# EasyEDA schematic main board_schematic.json
TITLE: Sheet_1; REV: 1.0; Date: 2021-07-18; Sheet: 1/1; Drawn By: Gustavo Moraes; Company: Your Company
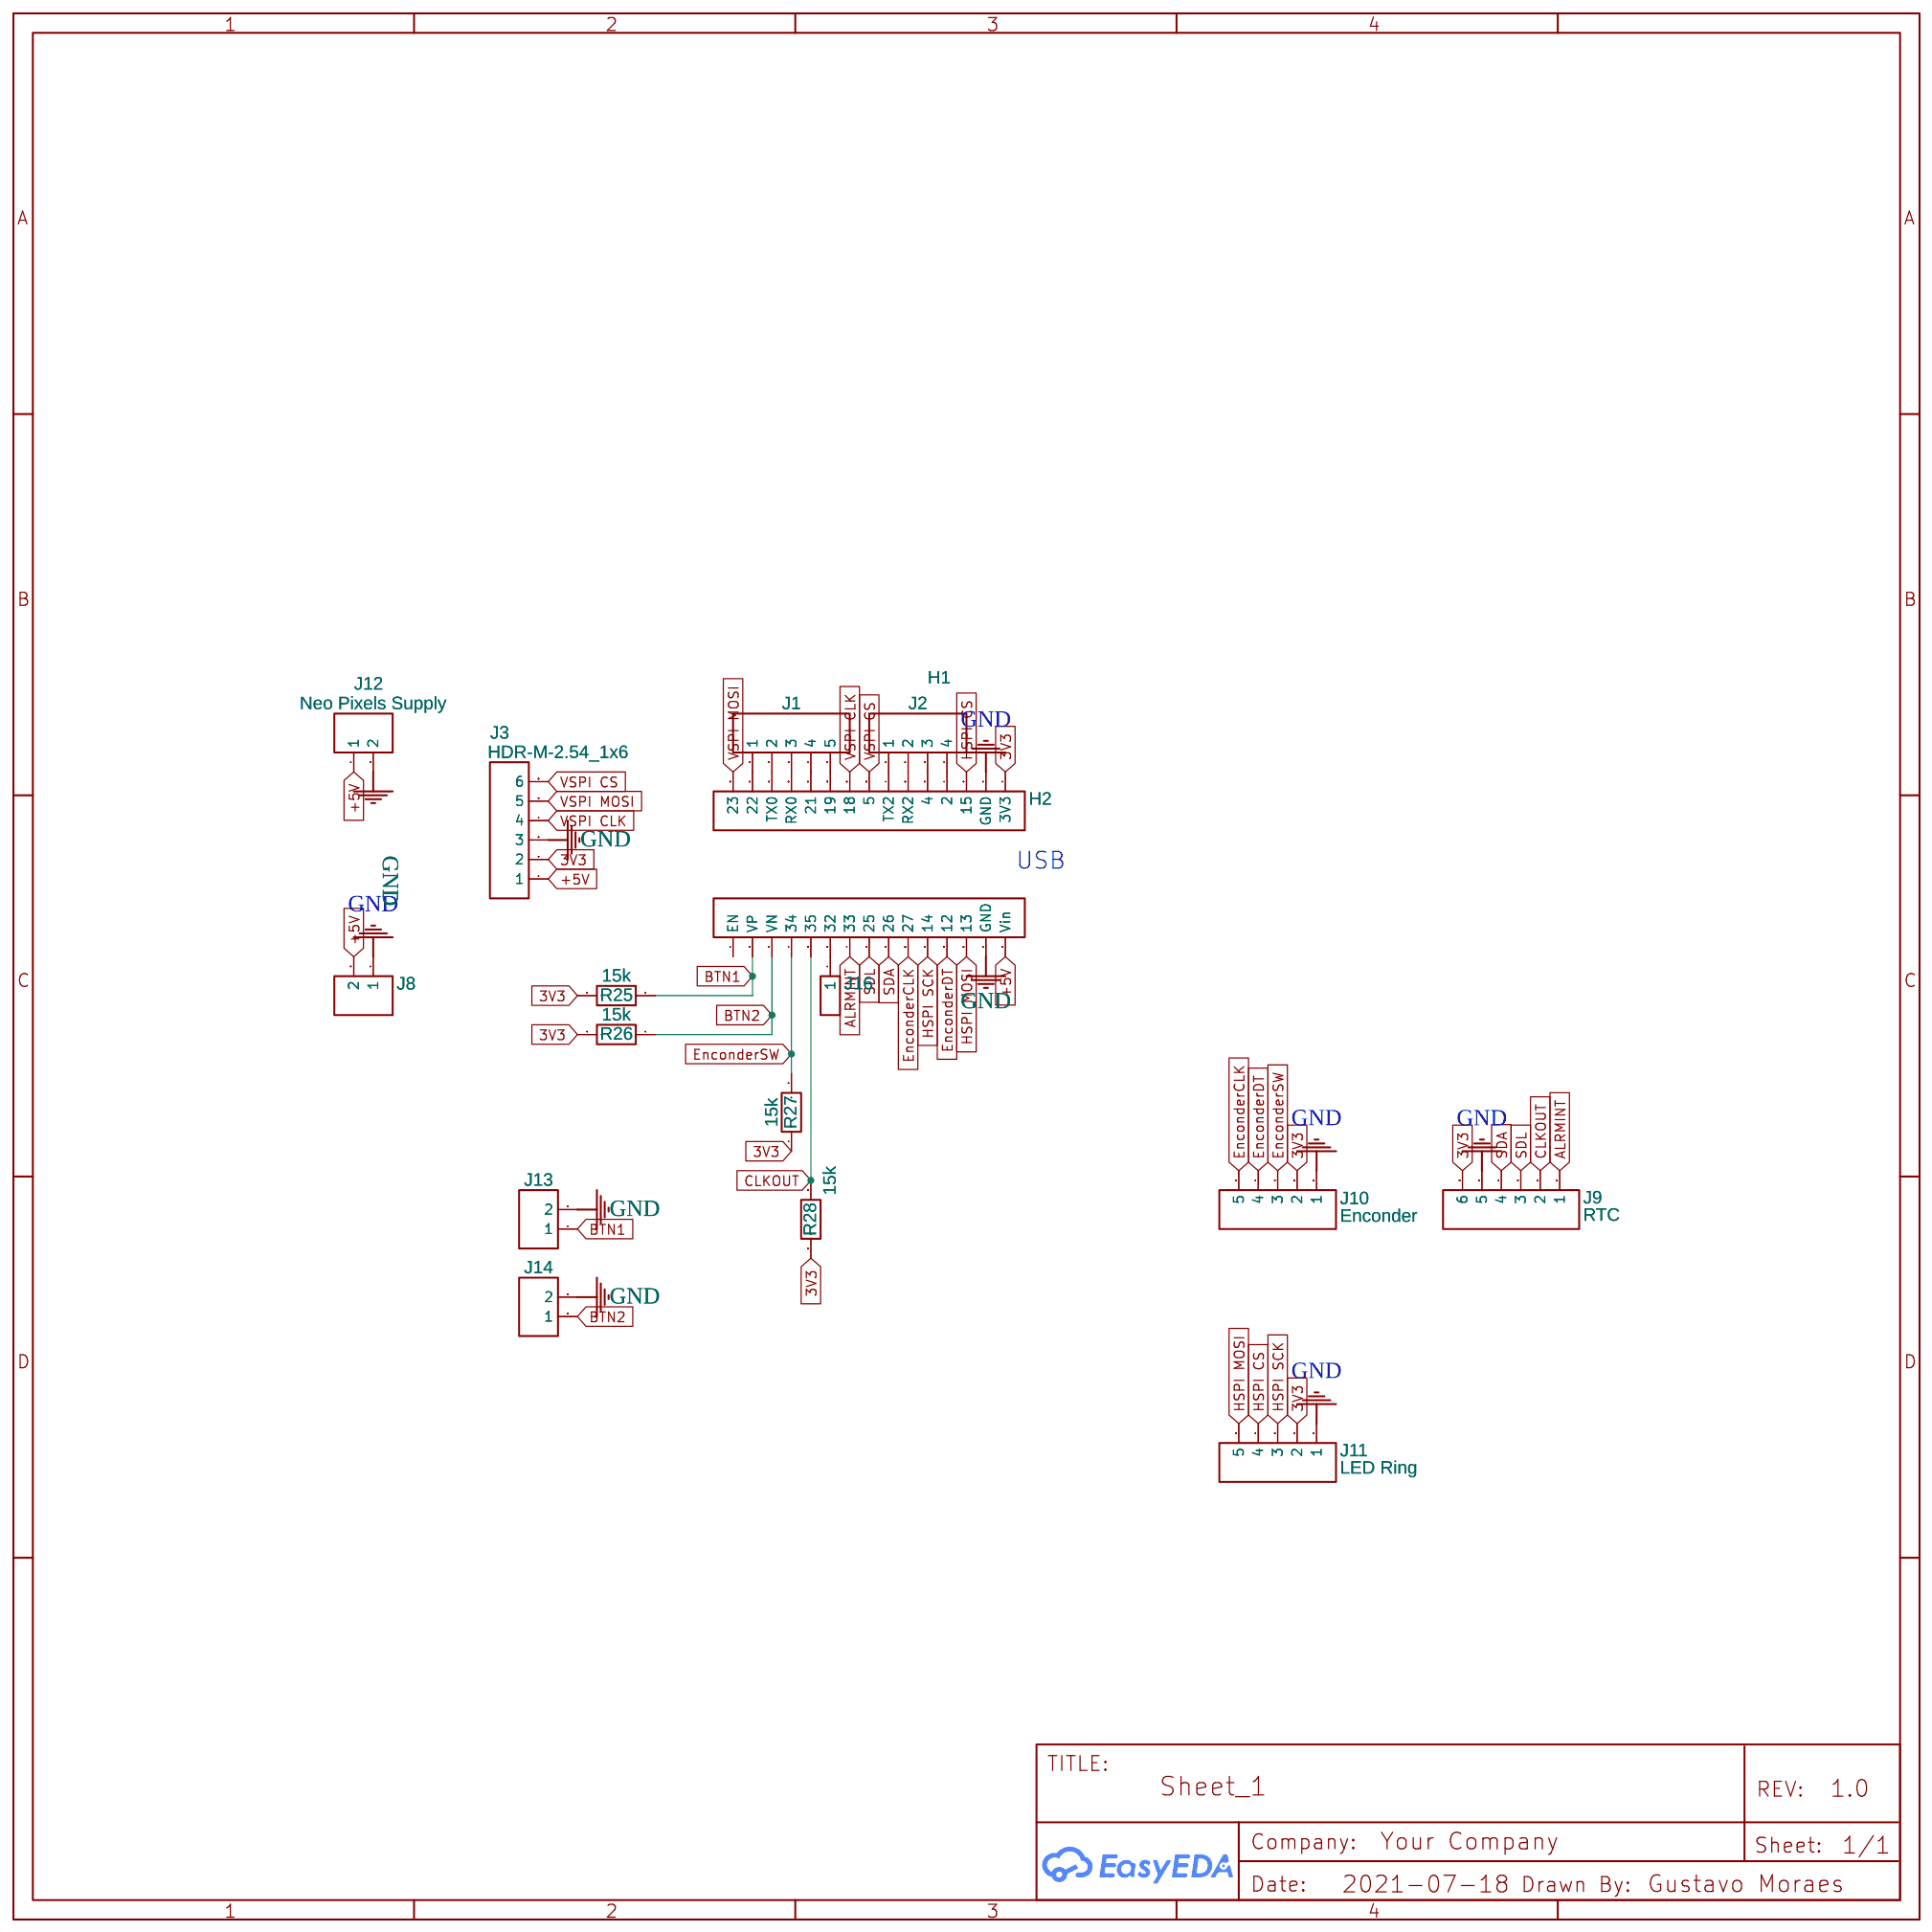
[diagram p0: schematic sheet]

## Parts
H1  HDR-F-2.54_1x15  [HDR-F-2.54_1X15]
H2  HDR-F-2.54_1x15  [HDR-F-2.54_1X15]
J1  HDR-M-2.54_1x5  [HDR-M-2.54_1X5]
J2  HDR-M-2.54_1x4  [HDR-M-2.54_1X4]
J3  HDR-M-2.54_1x6  [HDR-M-2.54_1X6]
J8  HDR-M-2.54_1x2  [HDR-M-2.54_1X2]
J9  RTC  [HDR-M-2.54_1X6]
J10  Enconder  [HDR-M-2.54_1X5]
J11  LED Ring  [HDR-M-2.54_1X5]
J12  Neo Pixels Supply  [HDR-M-2.54_1X2]
J13  HDR-M-2.54_1x2  [HDR-M-2.54_1X2]
J14  HDR-M-2.54_1x2  [HDR-M-2.54_1X2]
J16  HDR-M-2.54_1x1  [HDR-M-2.54_1X1]
R25  15k  [R_AXIAL-0.3]
R26  15k  [R_AXIAL-0.3]
R27  15k  [R_AXIAL-0.3]
R28  15k  [R_AXIAL-0.3]

## Library data of the parts
H1 H2 = HDR-F-2.54_1x15: Supplier Part: C124408; Supplier: LCSC; Contributor: LCEDA_Lib
J1 J10 J11 = HDR-M-2.54_1x5: Supplier Part: C358687; Supplier: LCSC; Contributor: LCEDA_Lib
J2 = HDR-M-2.54_1x4: Supplier Part: C124378; Supplier: LCSC; Contributor: LCEDA_Lib
J3 J9 = HDR-M-2.54_1x6: Supplier Part: C190819; Supplier: LCSC; Contributor: LCEDA_Lib
J8 J12-J14 = HDR-M-2.54_1x2: Supplier Part: C124375; Supplier: LCSC; Contributor: LCEDA_Lib
J16 = HDR-M-2.54_1x1: Supplier Part: C81276; Supplier: LCSC; Contributor: LCEDA_Lib
R25-R28 = R_AXIAL-0.3_EU: Contributor: LCEDA_Lib

## Nets
3V3: H2.1(3V3) J3.2 J9.6 J10.2 J11.2 R25.2 R26.2 R27.1 R28.1
+5V: H1.15(Vin) J3.1 J8.2 J12.1
GND: H1.14(GND) H2.2(GND) J3.3 J8.1 J9.5 J10.1 J11.1 J12.2 J13.2 J14.2
ALRMINT: H1.7(33) J9.1
BTN1: H1.2(VP) J13.1 R25.1
BTN2: H1.3(VN) J14.1 R26.1
CLKOUT: H1.5(35) J9.2 R28.2
EnconderCLK: H1.10(27) J10.5
EnconderDT: H1.12 J10.4
EnconderSW: H1.4(34) J10.3 R27.2
HSPI CS: H2.3(15) J11.4
HSPI MOSI: H1.13 J11.5
HSPI SCK: H1.11(14) J11.3
SDA: H1.9(26) J9.4
SDL: H1.8(25) J9.3
VSPI CLK: H2.9(18) J3.4
VSPI CS: H2.8(5) J3.6
VSPI MOSI: H2.15(23) J3.5
Net-(H1-6): H1.6(32) J16.1
Net-(H2-4): H2.4(2) J2.4
Net-(H2-5): H2.5(4) J2.3
Net-(H2-6): H2.6(RX2) J2.2
Net-(H2-7): H2.7(TX2) J2.1
Net-(H2-10): H2.10(19) J1.5
Net-(H2-11): H2.11(21) J1.4
Net-(H2-12): H2.12(RX0) J1.3
Net-(H2-13): H2.13(TX0) J1.2
Net-(H2-14): H2.14(22) J1.1

Not connected (* = marked no-connect by the designer): H1 1(EN)

## Notes on the sheet
- USB
